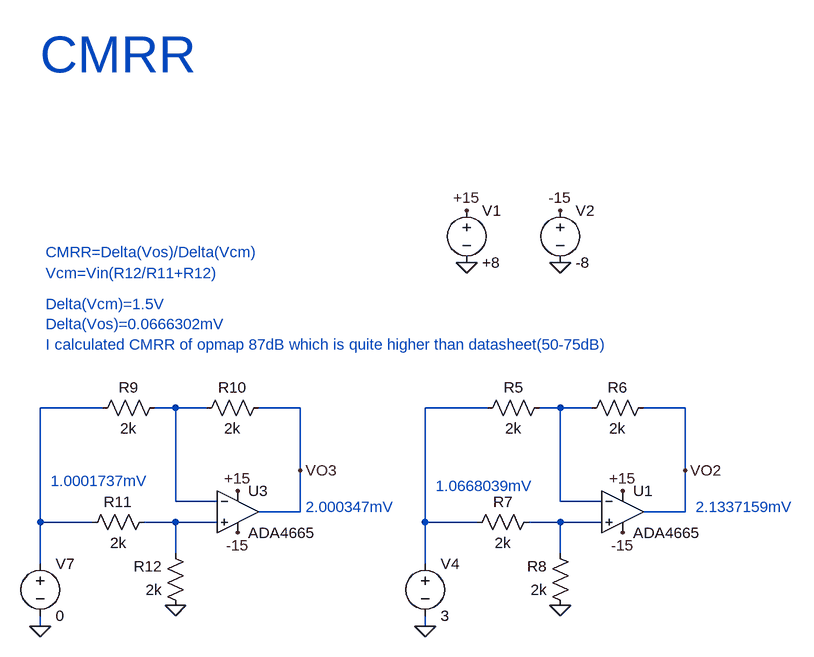
[diagram p0: schematic CMRR.asc]
CMRR.asc, the LTspice schematic file:
Version 4
SHEET 1 1664 1080
WIRE -752 176 -848 176
WIRE -640 176 -672 176
WIRE -592 176 -640 176
WIRE -448 176 -512 176
WIRE -160 176 -256 176
WIRE -48 176 -80 176
WIRE 0 176 -48 176
WIRE 144 176 80 176
WIRE -448 272 -448 176
WIRE 144 272 144 176
WIRE -640 320 -640 176
WIRE -576 320 -640 320
WIRE -48 320 -48 176
WIRE 16 320 -48 320
WIRE -448 336 -448 272
WIRE -448 336 -512 336
WIRE 144 336 144 272
WIRE 144 336 80 336
WIRE -848 352 -848 176
WIRE -768 352 -848 352
WIRE -640 352 -688 352
WIRE -576 352 -640 352
WIRE -256 352 -256 176
WIRE -176 352 -256 352
WIRE -48 352 -96 352
WIRE 16 352 -48 352
WIRE -640 400 -640 352
WIRE -48 400 -48 352
WIRE -848 416 -848 352
WIRE -256 416 -256 352
WIRE -848 512 -848 496
WIRE -256 512 -256 496
FLAG -192 -128 +15
FLAG -192 -48 0
FLAG -48 -48 0
FLAG -48 -128 -15
FLAG 48 304 +15
FLAG 48 368 -15
FLAG -48 480 0
FLAG -256 512 0
FLAG 144 272 VO2
FLAG -640 480 0
FLAG -848 512 0
FLAG -448 272 VO3
FLAG -544 304 +15
FLAG -544 368 -15
SYMBOL voltage -192 -144 R0
WINDOW 123 0 0 Left 0
WINDOW 39 0 0 Left 0
SYMATTR InstName V1
SYMATTR Value +8
SYMBOL voltage -48 -144 R0
WINDOW 123 0 0 Left 0
WINDOW 39 0 0 Left 0
SYMATTR InstName V2
SYMATTR Value -8
SYMBOL res -64 160 R90
WINDOW 0 0 56 VBottom 2
WINDOW 3 32 56 VTop 2
SYMATTR InstName R5
SYMATTR Value 2k
SYMBOL res 96 160 R90
WINDOW 0 0 56 VBottom 2
WINDOW 3 32 56 VTop 2
SYMATTR InstName R6
SYMATTR Value 2k
SYMBOL res -80 336 R90
WINDOW 0 0 56 VBottom 2
WINDOW 3 32 56 VTop 2
SYMATTR InstName R7
SYMATTR Value 2k
SYMBOL res -32 496 R180
WINDOW 0 36 76 Left 2
WINDOW 3 36 40 Left 2
SYMATTR InstName R8
SYMATTR Value 2k
SYMBOL voltage -256 400 R0
WINDOW 123 0 0 Left 0
WINDOW 39 0 0 Left 0
SYMATTR InstName V4
SYMATTR Value 3
SYMBOL res -656 160 R90
WINDOW 0 0 56 VBottom 2
WINDOW 3 32 56 VTop 2
SYMATTR InstName R9
SYMATTR Value 2k
SYMBOL res -496 160 R90
WINDOW 0 0 56 VBottom 2
WINDOW 3 32 56 VTop 2
SYMATTR InstName R10
SYMATTR Value 2k
SYMBOL res -672 336 R90
WINDOW 0 0 56 VBottom 2
WINDOW 3 32 56 VTop 2
SYMATTR InstName R11
SYMATTR Value 2k
SYMBOL res -624 496 R180
WINDOW 0 36 76 Left 2
WINDOW 3 36 40 Left 2
SYMATTR InstName R12
SYMATTR Value 2k
SYMBOL voltage -848 400 R0
WINDOW 123 0 0 Left 0
WINDOW 39 0 0 Left 0
SYMATTR InstName V7
SYMATTR Value 0
SYMBOL Opamps\\ADA4665 -544 272 R0
SYMATTR InstName U3
SYMBOL Opamps\\ADA4665 48 272 R0
SYMATTR InstName U1
TEXT -848 -368 Left 6 ;CMRR
TEXT -440 328 Left 2 ;2.000347mV
TEXT -832 288 Left 2 ;1.0001737mV
TEXT -840 -64 Left 2 ;CMRR=Delta(Vos)/Delta(Vcm)
TEXT -840 -32 Left 2 ;Vcm=Vin(R12/R11+R12)
TEXT 160 328 Left 2 ;2.1337159mV
TEXT -240 296 Left 2 ;1.0668039mV
TEXT -840 16 Left 2 ;Delta(Vcm)=1.5V\nDelta(Vos)=0.0666302mV\nI calculated CMRR of opmap 87dB which is quite higher than datasheet(50-75dB)

The netlist it stands for:
* CMRR.asc
V1 +15 0 +8
V2 -15 0 -8
R5 N004 N003 2k
R6 VO2 N004 2k
R7 N006 N003 2k
R8 0 N006 2k
V4 N003 0 3
R9 N002 N001 2k
R10 VO3 N002 2k
R11 N005 N001 2k
R12 0 N005 2k
V7 N001 0 0
XU3 N005 N002 +15 -15 VO3 ADA4665  ; pins In+ In- V+ V- OUT
XU1 N006 N004 +15 -15 VO2 ADA4665  ; pins In+ In- V+ V- OUT
* CMRR
* 2.000347mV
* 1.0001737mV
* CMRR=Delta(Vos)/Delta(Vcm)
* Vcm=Vin(R12/R11+R12)
* 2.1337159mV
* 1.0668039mV
* Delta(Vcm)=1.5V
* Delta(Vos)=0.0666302mV
* I calculated CMRR of opmap 87dB which is quite higher than datasheet(50-75dB)
.backanno
.end